# EAGLE design MEGA Shield (EAGLE 9.0.1)
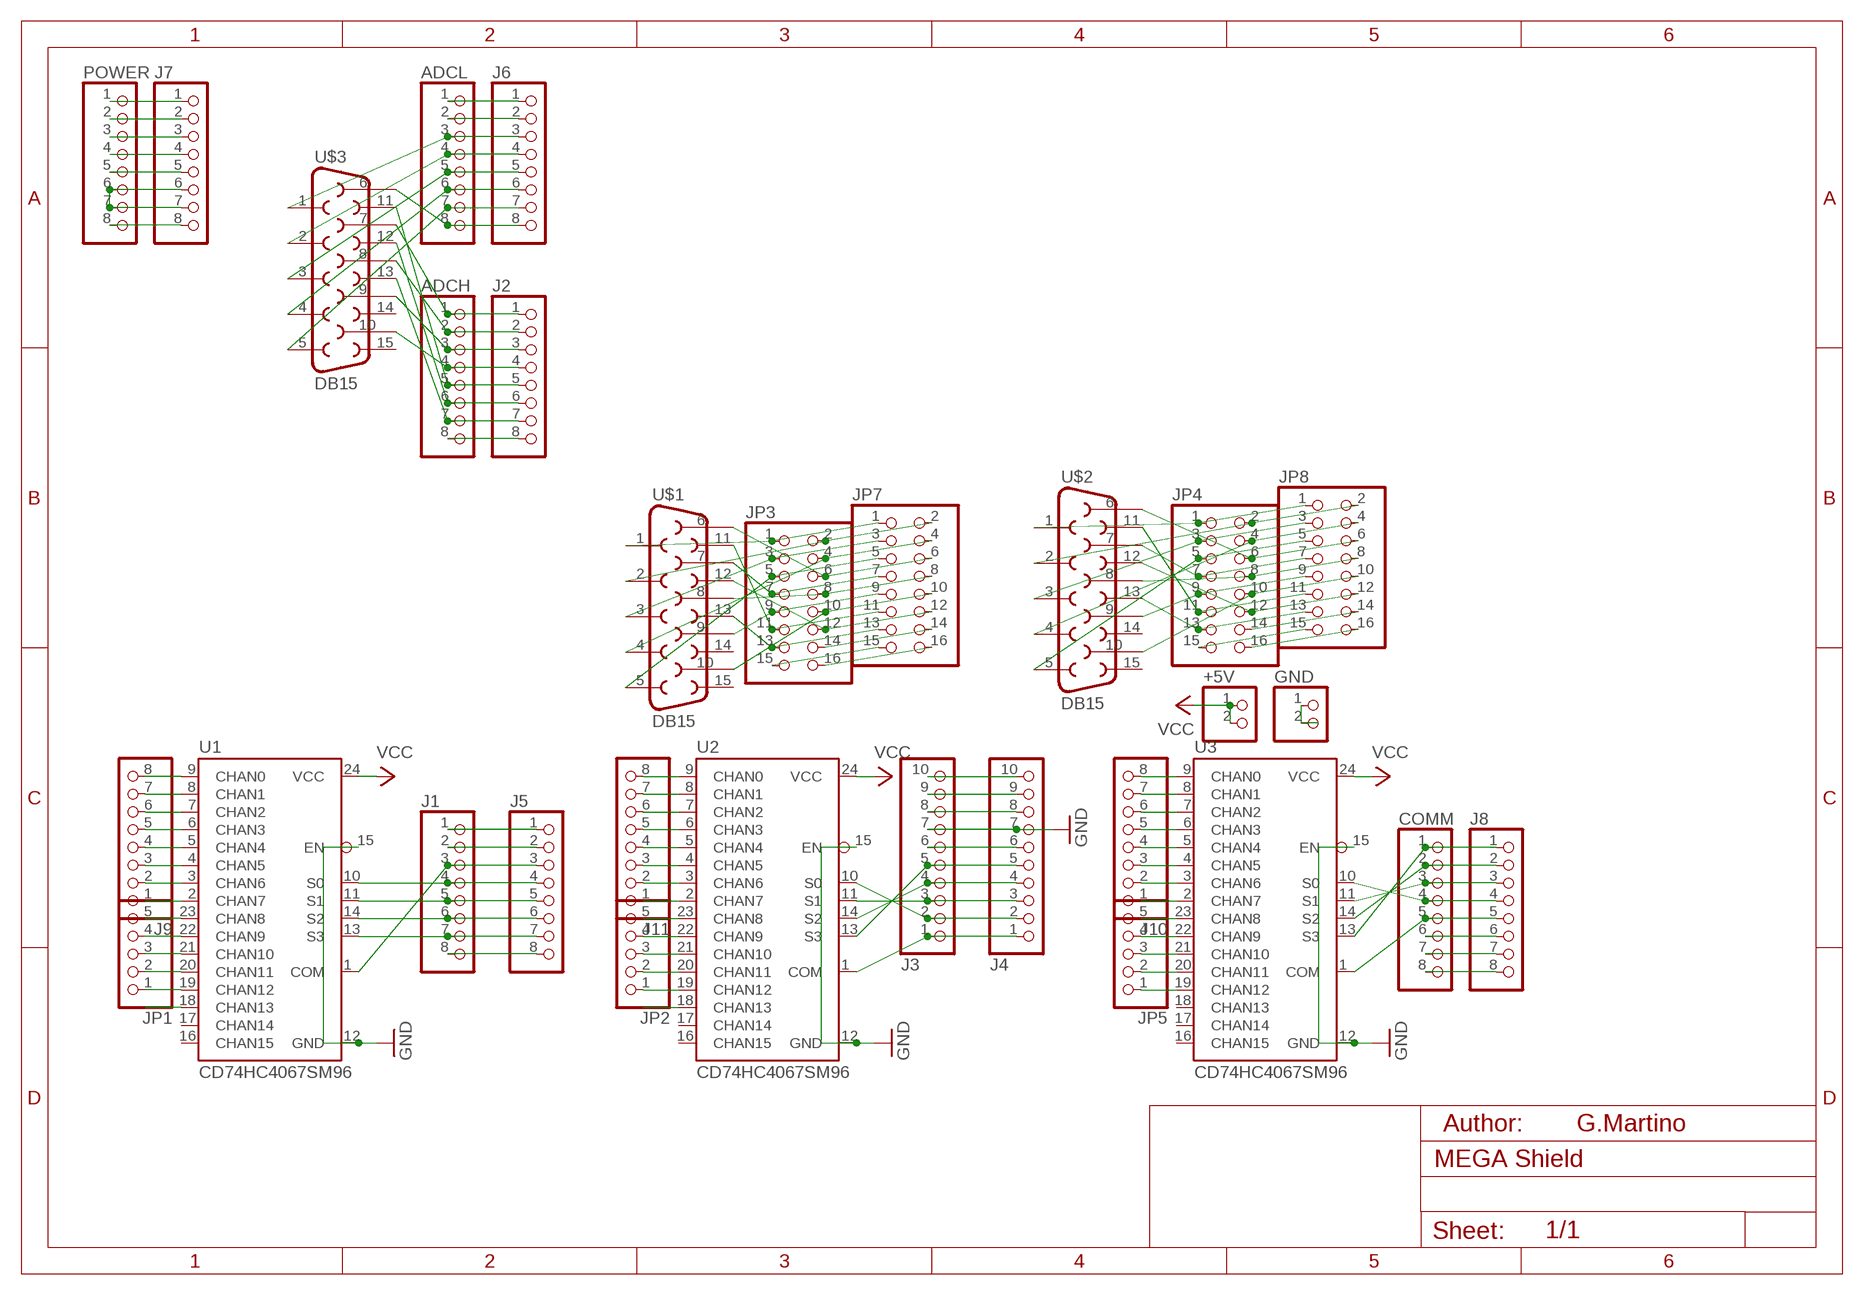
[diagram p0: schematic, sheet 1]

## Parts
+5V  PINHD-1X2  [1X02]
ADCH  PINHD-1X8TH  [1X08-TH]
ADCL  PINHD-1X8TH  [1X08-TH]
COMM  PINHD-1X8TH  [1X08-TH]
GND  PINHD-1X2  [1X02]
J1  PINHD-1X8TH  [1X08-TH]
J2  PINHD-1X8TH  [1X08-TH]
J3  PINHD-1X10TH  [1X10-TH]
J4  PINHD-1X10TH  [1X10-TH]
J5  PINHD-1X8TH  [1X08-TH]
J6  PINHD-1X8TH  [1X08-TH]
J7  PINHD-1X8TH  [1X08-TH]
J8  PINHD-1X8TH  [1X08-TH]
J9  PINHD-1X8TH  [1X08-TH]
J10  PINHD-1X8TH  [1X08-TH]
J11  PINHD-1X8TH  [1X08-TH]
JP1  PINHD-1X5  [1X05]
JP2  PINHD-1X5  [1X05]
JP3  PINHD-2X8  [2X08]
JP4  PINHD-2X8  [2X08]
JP5  PINHD-1X5  [1X05]
JP7  PINHD-2X8  [2X08]
JP8  PINHD-2X8  [2X08]
POWER  PINHD-1X8TH  [1X08-TH]
U1  CD74HC4067SM96  74HC4067SM96  [SSOP24]
U2  CD74HC4067SM96  74HC4067SM96  [SSOP24]
U3  CD74HC4067SM96  74HC4067SM96  [SSOP24]
U$1  DB15  [DB15]
U$2  DB15  [DB15]
U$3  DB15  [DB15]

## Nets
+9V: J7.8 POWER.8
GND: J3.7 J4.7 U1.12(GND) U1.15(EN) U2.12(GND) U2.15(EN) U3.12(GND) U3.15(EN)
N$1: GND.1 GND.2
N$2: J3.1 J4.1 U2.1(COM)
N$3: J3.6 J4.6
N$4: J7.5 POWER.5
N$5: J3.4 J4.4 U2.14(S2)
N$6: J3.2 J4.2 U2.10(S0)
N$7: J3.3 J4.3 U2.11(S1)
N$8: J1.1 J5.1
N$9: J1.2 J5.2
N$10: J1.3 J5.3 U1.1(COM)
N$11: J1.4 J5.4 U1.10(S0)
N$12: J1.5 J5.5 U1.11(S1)
N$13: J1.6 J5.6 U1.14(S2)
N$14: J1.7 J5.7 U1.13(S3)
N$15: J1.8 J5.8
N$16: J7.6 J7.7 POWER.6 POWER.7
N$17: J9.8 U1.9(CHAN0)
N$18: ADCL.1 J6.1
N$19: ADCL.2 J6.2
N$20: ADCL.3 J6.3 U$3.1
N$21: ADCL.4 J6.4 U$3.2
N$22: ADCL.5 J6.5 U$3.3
N$23: ADCL.6 J6.6 U$3.4
N$24: J9.7 U1.8(CHAN1)
N$25: J9.6 U1.7(CHAN2)
N$26: J9.5 U1.6(CHAN3)
N$27: J9.4 U1.5(CHAN4)
N$28: J9.3 U1.4(CHAN5)
N$29: J9.2 U1.3(CHAN6)
N$30: J9.1 U1.2(CHAN7)
N$31: JP1.5 U1.23(CHAN8)
N$32: JP1.4 U1.22(CHAN9)
N$33: JP1.3 U1.21(CHAN10)
N$34: JP1.2 U1.20(CHAN11)
N$35: JP1.1 U1.19(CHAN12)
N$36: U1.18(CHAN13)
N$37: J10.8 U3.9(CHAN0)
N$38: ADCL.7 J6.7 U$3.5
N$39: J10.7 U3.8(CHAN1)
N$40: J11.8 U2.9(CHAN0)
N$41: J11.7 U2.8(CHAN1)
N$42: J11.6 U2.7(CHAN2)
N$43: J11.5 U2.6(CHAN3)
N$44: J11.4 U2.5(CHAN4)
N$45: J11.3 U2.4(CHAN5)
N$46: J11.2 U2.3(CHAN6)
N$47: J11.1 U2.2(CHAN7)
N$48: JP2.5 U2.23(CHAN8)
N$49: JP2.4 U2.22(CHAN9)
N$50: JP2.3 U2.21(CHAN10)
N$51: JP2.2 U2.20(CHAN11)
N$52: JP2.1 U2.19(CHAN12)
N$53: U2.18(CHAN13)
N$54: J10.6 U3.7(CHAN2)
N$55: J10.5 U3.6(CHAN3)
N$56: J10.4 U3.5(CHAN4)
N$57: J10.3 U3.4(CHAN5)
N$58: J10.2 U3.3(CHAN6)
N$59: J10.1 U3.2(CHAN7)
N$60: JP5.5 U3.23(CHAN8)
N$61: JP5.4 U3.22(CHAN9)
N$62: JP5.3 U3.21(CHAN10)
N$63: ADCL.8 J6.8 U$3.6
N$64: ADCH.1 J2.1 U$3.7
N$65: JP5.2 U3.20(CHAN11)
N$66: JP5.1 U3.19(CHAN12)
N$88: ADCH.2 J2.2 U$3.8
N$89: ADCH.3 J2.3 U$3.9
N$116: ADCH.4 J2.4 U$3.10
N$121: ADCH.5 J2.5 U$3.11
N$124: ADCH.6 J2.6 U$3.12
N$125: J7.4 POWER.4
N$126: J3.9 J4.9
N$127: ADCH.7 J2.7 U$3.13
N$128: ADCH.8 J2.8
N$129: COMM.1 J8.1 U3.13(S3)
N$130: COMM.2 J8.2 U3.14(S2)
N$133: COMM.3 J8.3 U3.11(S1)
N$134: COMM.4 J8.4 U3.10(S0)
N$136: COMM.5 J8.5 U3.1(COM)
N$137: COMM.6 J8.6
N$138: COMM.7 J8.7
N$139: COMM.8 J8.8
N$140: J3.5 J4.5 U2.13(S3)
N$142: JP3.1 JP7.1 U$1.1
N$144: JP3.2 JP7.2 U$1.2
N$145: JP3.3 JP7.3 U$1.3
N$146: JP3.4 JP7.4 U$1.4
N$147: JP3.5 JP7.5 U$1.5
N$148: JP3.6 JP7.6 U$1.6
N$149: JP3.7 JP7.7 U$1.7
N$150: JP3.8 JP7.8 U$1.8
N$151: JP3.9 JP7.9 U$1.9
N$152: JP3.10 JP7.10 U$1.10
N$154: JP3.11 JP7.11 U$1.11
N$157: JP3.12 JP7.12 U$1.12
N$158: JP3.13 JP7.13 U$1.13
N$159: JP3.14 JP7.14
N$160: JP3.15 JP7.15
N$161: JP3.16 JP7.16
N$162: JP4.1 JP8.1 U$2.1
N$163: JP4.2 JP8.2 U$2.2
N$164: JP4.3 JP8.3 U$2.3
N$166: JP4.4 JP8.4 U$2.4
N$169: JP4.5 JP8.5 U$2.5
N$170: JP4.6 JP8.6 U$2.6
N$171: JP4.7 JP8.7 U$2.7
N$172: JP4.8 JP8.8 U$2.8
N$173: JP4.9 JP8.9 U$2.9
N$174: JP4.10 JP8.10 U$2.10
N$175: JP4.11 JP8.11 U$2.11
N$176: JP4.12 JP8.12 U$2.12
N$181: JP4.13 JP8.13 U$2.13
N$182: JP4.14 JP8.14
N$183: JP4.15 JP8.15
N$184: JP4.16 JP8.16
N$219: J7.2 POWER.2
N$220: J7.1 POWER.1
N$222: J3.8 J4.8
N$223: J3.10 J4.10
RESET: J7.3 POWER.3
VCC: +5V.1 +5V.2 U1.24(VCC) U2.24(VCC) U3.24(VCC)
Unconnected: U1.16(CHAN15) U1.17(CHAN14) U2.16(CHAN15) U2.17(CHAN14) U3.16(CHAN15) U3.17(CHAN14) U3.18(CHAN13) U$1.14 U$1.15 U$2.14 U$2.15 U$3.14 U$3.15

## Notes on the sheet
- G.Martino

## Library data of the parts
+5V GND = pinhead:PINHD-1X2: PIN HEADER
ADCH ADCL COMM J1 J2 J5-J11 POWER = Smartprj:PINHD-1X8: PIN HEADER
J3 J4 = Smartprj:PINHD-1X10: PIN HEADER
JP1 JP2 JP5 = pinhead:PINHD-1X5: PIN HEADER
JP3 JP4 JP7 JP8 = pinhead:PINHD-2X8: PIN HEADER
U1-U3 = SparkFun-IC-Logic:74*4067: 16-channel analog MUX Datasheet <http://www.sparkfun.com/datasheets/IC/cd74hc4067.pdf> SparkFun Products MP3 Trigger <https://www.sparkfun.com/products/13720> (WIG-13720) SparkFun Analog/Digital MUX Breakout - CD74HC4067 <https://www.sparkfun.com/products/9056> (BOB-09056); PROD_ID: IC-08252
U$1-U$3 = SparkFun-Retired:DB15: DB15 / VGA right angle through-hole female connector.

## Board
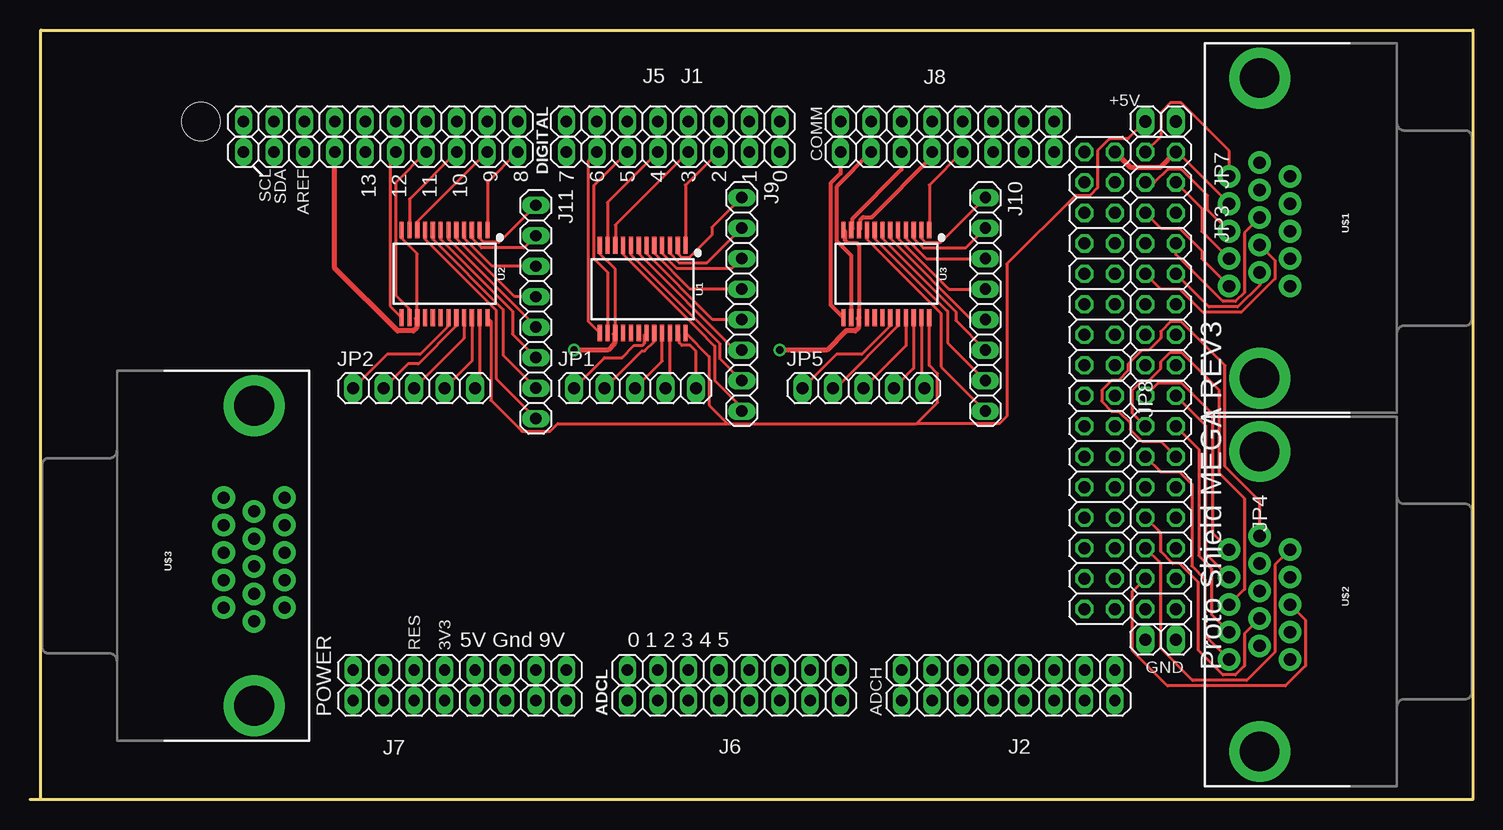
[diagram p1: board, top side]
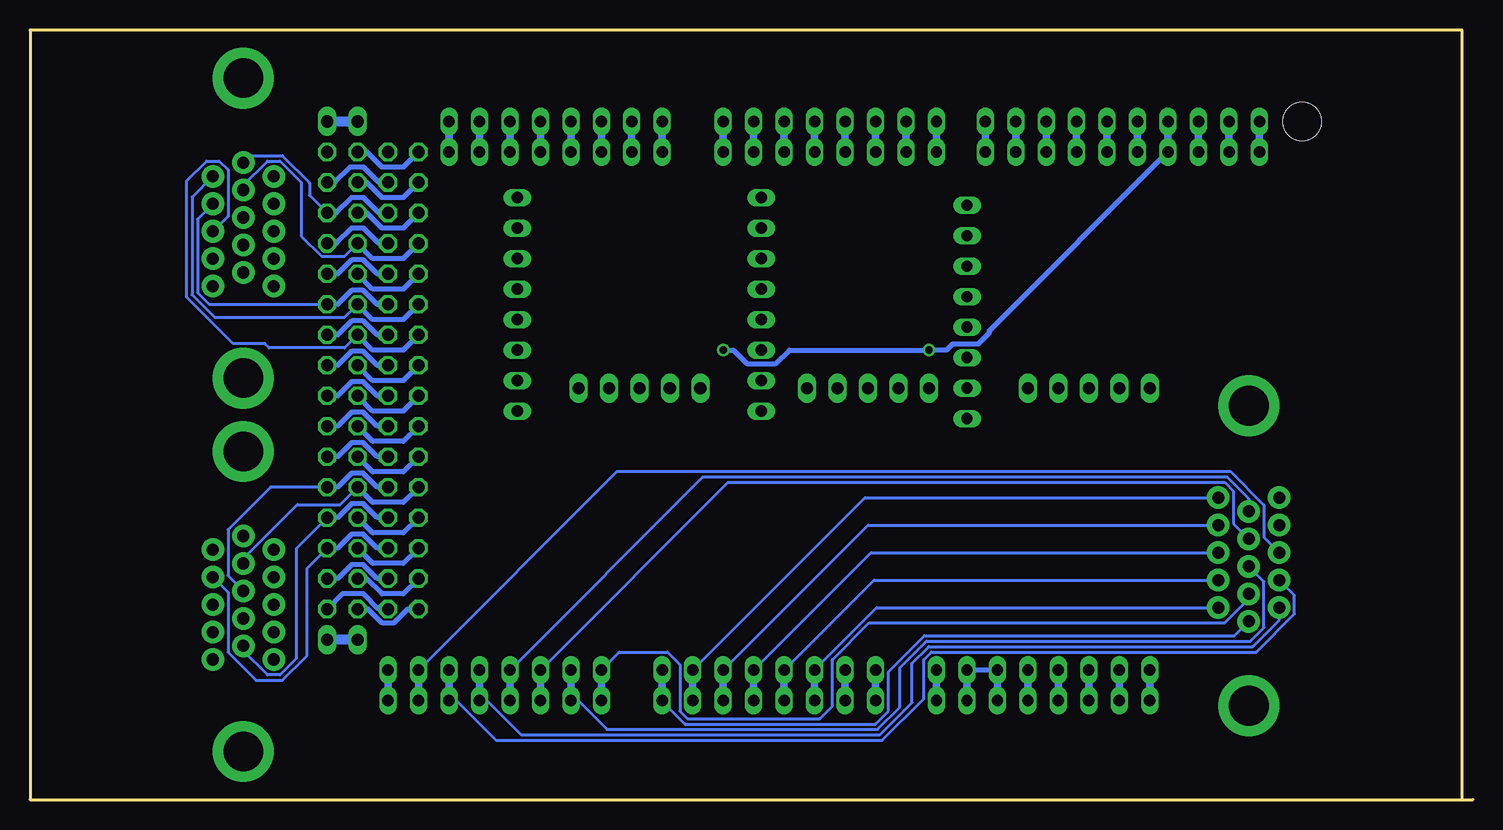
[diagram p2: board, bottom side, seen from below]

Size 120.28 x 64.14 mm. Coordinates in mm from the lower left corner, seen from the top.
Outline: 0.91,0 120.28,0 120.28,64.14 0.91,64.14 0.91,0
Outline: 0.91,0 0,0
Copper layers (1*16): Top 0.035mm / dielectric 1.5mm / Bottom 0.035mm
Design rules "default *": minimum track width 10mil, minimum drill 24mil, track to track 8mil, track to pad 8mil, pad to pad 8mil, via to via 8mil, smd to smd 8mil, copper to edge 40mil, drill to drill 8mil, minimum pad ring 10mil, minimum via ring 8mil, stop-mask expansion 2mil, vias tented up to drill 0mil, thermal gap 10mil
Holes 3.2 mm at 14.24,56.52

### Footprints (pad centres in the part's own frame; a part is rotated, then mirrored left to right if it is on the bottom)
1X02 = drill 1.016 long: 1 -1.27,0; 2 1.27,0
1X08-TH = drill 0.95 pad 1.422 long: 1 -8.89,0; 2 -6.35,0; 3 -3.81,0; 4 -1.27,0; 5 1.27,0; 6 3.81,0; 7 6.35,0; 8 8.89,0
1X10-TH = drill 0.95 pad 1.422 long: 1 -11.43,0; 2 -8.89,0; 3 -6.35,0; 4 -3.81,0; 5 -1.27,0; 6 1.27,0; 7 3.81,0; 8 6.35,0; 9 8.89,0; 10 11.43,0
1X05 = drill 1.016 long: 1 -5.08,0; 2 -2.54,0; 3 0,0; 4 2.54,0; 5 5.08,0
2X08 = drill 1.016 octagon: 1 -8.89,-1.27; 2 -8.89,1.27; 3 -6.35,-1.27; 4 -6.35,1.27; 5 -3.81,-1.27; 6 -3.81,1.27; 7 -1.27,-1.27; 8 -1.27,1.27; 9 1.27,-1.27; 10 1.27,1.27; 11 3.81,-1.27; 12 3.81,1.27; 13 6.35,-1.27; 14 6.35,1.27; 15 8.89,-1.27; 16 8.89,1.27
SSOP24 = smd 0.348 x 1.397: 1 -3.575,-3.656; 2 -2.925,-3.656; 3 -2.275,-3.656; 4 -1.625,-3.656; 5 -0.975,-3.656; 6 -0.325,-3.656; 7 0.325,-3.656; 8 0.975,-3.656; 9 1.625,-3.656; 10 2.275,-3.656; 11 2.925,-3.656; 12 3.575,-3.656; 13 3.575,3.656; 14 2.925,3.656; 15 2.275,3.656; 16 1.625,3.656; 17 0.975,3.656; 18 0.325,3.656; 19 -0.325,3.656; 20 -0.975,3.656; 21 -1.625,3.656; 22 -2.275,3.656; 23 -2.925,3.656; 24 -3.575,3.656
DB15 = drill 1.016 pad 1.88: 1 -4.32,-7.62; 2 -2.03,-7.62; 3 0.26,-7.62; 4 2.55,-7.62; 5 4.84,-7.62; 6 -5.46,-5.08; 7 -3.17,-5.08; 8 -0.88,-5.08; 9 1.41,-5.08; 10 3.7,-5.08; 11 -4.32,-2.54; 12 -2.03,-2.54; 13 0.26,-2.54; 14 2.55,-2.54; 15 4.84,-2.54 | drill 3.302 pad 5.08: G1 -12.5,-5.08; G2 12.5,-5.08

### Placement (x,y rotation side)
+5V  94.25,56.52 0 top
ADCH  81.55,8.25 0 top
ADCL  58.69,8.25 0 top
COMM  76.47,56.52 0 top
GND  94.25,13.34 0 top
J1  53.61,56.52 180 top
J2  81.55,10.79 0 top
J3  29.23,56.52 180 top
J4  29.23,53.97 180 top
J5  53.61,53.97 180 top
J6  58.69,10.79 0 top
J7  35.83,8.25 0 top
J8  76.47,53.97 0 top
J9  59.33,41.28 270 top
J10  79.64,41.28 270 top
J11  42.18,40.64 270 top
JP1  50.44,34.29 0 top
JP2  32.02,34.29 0 top
JP3  94.25,45.08 270 top
JP4  94.25,24.77 270 top
JP5  69.48,34.29 0 top
JP7  89.17,45.08 270 top
JP8  89.17,24.77 270 top
POWER  35.83,10.79 0 top
U1  51.07,42.55 180 top
U2  34.56,43.81 180 top
U3  71.39,43.81 180 top
U$1  107.58,47.62 270 top
U$2  107.58,16.51 270 top
U$3  13.61,20.32 90 top

### Tracks (layer width: path | path; a pad name or v marks a point on that pad's centre or on a via)
+9V
  Bottom 0.61: J7.8 POWER.8
GND  (via drill 0.61)
  Top 0.254: U1.15 48.8,44.2 47.49,45.5 U1.12 | U2.15 32.28,45.47 30.98,46.77 U2.12
  Top 0.33: U3.15 69.11,46.17 68.88,46.4 68.14,46.4 67.92,46.62 67.92,47.36 U3.12
  Top 0.406: U2.15 32.22,40.09 32.22,39.29 31.98,39.05 30.64,39.05 25.42,44.28 J4.7 | U1.15 48.73,38.82 48.73,38.02 48.17,37.47 v45.35,37.47 | v62.5,37.47 66.42,37.47 68.01,39.05 68.81,39.05 69.05,39.29 69.05,40.09 U3.15
  Bottom 0.406: J4.7 40.32,39.08 40.32,38.9 41.25,37.97 43.38,37.97 43.88,37.47 v45.35,37.47 56.99,37.47 58.13,36.33 60.52,36.33 61.66,37.47 v62.5,37.47
  Bottom 0.61: J4.7 J3.7
N$1
  Bottom 0.813: GND.1 GND.2
N$2
  Top 0.254: J4.1 38.13,51.45 U2.1
  Bottom 0.61: J4.1 J3.1
N$3
  Bottom 0.61: J4.6 J3.6
N$4
  Bottom 0.61: POWER.5 J7.5
N$5
  Top 0.254: J4.4 30.48,51.42 30.48,42.01 31.63,40.86 U2.14
  Bottom 0.61: J4.4 J3.4
N$6
  Top 0.254: J4.2 38.1,53.97 32.28,48.16 U2.10
  Bottom 0.61: J4.2 J3.2
N$7
  Top 0.254: J4.3 31.63,50.03 U2.11
  Bottom 0.61: J4.3 J3.3
N$8
  Bottom 0.61: J5.1 J1.1
N$9
  Bottom 0.61: J5.2 J1.2
N$10
  Top 0.254: J5.3 54.65,51.2 U1.1
  Bottom 0.61: J5.3 J1.3
N$11
  Top 0.254: J5.4 48.8,47.89 U1.10
  Bottom 0.61: J5.4 J1.4
N$12
  Top 0.254: J5.5 48.15,49.78 U1.11
  Bottom 0.61: J5.5 J1.5
N$13
  Top 0.254: J5.6 46.99,51.17 46.99,45.11 48.15,43.95 U1.14
  Bottom 0.61: J5.6 J1.6
N$14
  Top 0.254: J5.7 46.53,53.25 46.53,39.85 U1.13
  Bottom 0.61: J5.7 J1.7
N$15
  Bottom 0.61: J5.8 J1.8
N$16
  Bottom 0.406: POWER.6 POWER.7
  Bottom 0.61: POWER.6 J7.6 | POWER.7 J7.7
N$17
  Top 0.254: U1.9 49.45,45.43 55.51,39.36 55.63,39.24 57.07,37.8 57.07,34.95 59.33,32.7 J9.8
N$18
  Bottom 0.61: ADCL.1 J6.1
N$19
  Bottom 0.61: ADCL.2 J6.2
N$20
  Bottom 0.254: J6.3 54.88,10.84 49.72,16 U$3.1
  Bottom 0.61: ADCL.3 J6.3
N$21
  Bottom 0.254: J6.4 49.92,18.29 U$3.2
  Bottom 0.61: ADCL.4 J6.4
N$22
  Bottom 0.254: J6.5 50.17,20.58 U$3.3
  Bottom 0.61: ADCL.5 J6.5
N$23
  Bottom 0.254: J6.6 50.42,22.87 U$3.4
  Bottom 0.61: ADCL.6 J6.6
N$24
  Top 0.254: J9.7 57.53,36.72 57.53,37.99 50.09,45.42 U1.8
N$25
  Top 0.254: J9.6 58.79,37.47 50.74,45.51 U1.7
N$26
  Top 0.254: J9.5 56.9,40 51.4,45.51 U1.6
N$27
  Top 0.254: J9.4 55.01,42.55 52.05,45.51 U1.5
N$28
  Top 0.254: J9.3 58.5,44.26 53.95,44.26 52.7,45.51 U1.4
N$29
  Top 0.254: J9.2 56.41,44.72 54.14,44.72 53.34,45.51 U1.3
N$30
  Top 0.254: J9.1 56.85,47.69 56.85,47.07 54.96,45.17 54.33,45.17 53.99,45.51 U1.2
N$31
  Top 0.254: JP1.5 55.52,37.37 55.02,37.86 54.33,37.86 54.14,38.05 54.14,38.74 U1.23
N$32
  Top 0.254: JP1.4 53.34,34.66 U1.22
N$33
  Top 0.254: JP1.3 52.7,36.55 U1.21
N$34
  Top 0.254: JP1.2 51.01,37.4 51.25,37.4 52.05,38.2 U1.20
N$35
  Top 0.254: JP1.1 47.9,36.83 49.34,36.83 50.37,37.86 51.06,37.86 51.25,38.05 51.25,38.74 U1.19
N$37
  Top 0.254: U3.9 69.77,46.7 75.95,40.51 75.95,36.08 J10.8
N$38
  Bottom 0.254: J6.7 50.67,25.16 U$3.5
  Bottom 0.61: ADCL.7 J6.7
N$39
  Top 0.254: U3.8 70.42,46.78 76.5,40.7 76.5,38.08 J10.7
N$40
  Top 0.254: J11.8 38.88,35.05 38.88,40.75 32.94,46.7 U2.9
N$41
  Top 0.254: U2.8 33.59,46.69 39.45,40.83 39.45,37.02 J11.7
N$42
  Top 0.254: U2.7 34.23,46.69 40.23,40.7 40.23,38.78 J11.6
N$43
  Top 0.254: U2.6 34.88,46.69 42.18,39.39 J11.5
N$44
  Top 0.254: J11.4 40.41,41.91 35.53,46.78 U2.5
N$45
  Top 0.254: J11.3 38.52,44.45 36.19,46.78 U2.4
N$46
  Top 0.254: J11.2 41.17,45.98 37.63,45.98 36.84,46.78 U2.3
N$47
  Top 0.254: J11.1 39.09,46.44 37.82,46.44 37.48,46.78 U2.2
N$48
  Top 0.254: U2.23 37.48,34.67 JP2.5
N$49
  Top 0.254: U2.22 36.84,36.56 JP2.4
N$50
  Top 0.254: U2.21 36.19,38.45 JP2.3
N$51
  Top 0.254: U2.20 35.53,39.47 32.38,36.32 31.51,36.32 JP2.2
N$52
  Top 0.254: U2.19 34.88,39.47 32.52,37.1 29.75,37.1 JP2.1
N$54
  Top 0.254: U3.7 71.06,46.78 77.17,40.67 77.17,39.94 J10.6
N$55
  Top 0.254: U3.6 71.72,46.78 78.49,40 J10.5
N$56
  Top 0.254: U3.5 72.36,46.78 76.6,42.55 J10.4
N$57
  Top 0.254: U3.4 73.02,46.78 74.71,45.08 J10.3
N$58
  Top 0.254: U3.3 73.67,46.78 74.46,45.98 78,45.98 J10.2
N$59
  Top 0.254: U3.2 74.31,46.78 74.65,46.44 75.92,46.44 J10.1
N$60
  Top 0.254: U3.23 74.31,34.54 JP5.5
N$61
  Top 0.254: U3.22 73.67,35.93 JP5.4
N$62
  Top 0.254: U3.21 73.02,37.82 JP5.3
N$63
  Bottom 0.254: J6.8 67.58,8.21 65.67,6.3 49.82,6.3 48.74,7.38 48.74,10.65 45.73,13.66 19.88,13.66 U$3.6
  Bottom 0.61: ADCL.8 J6.8
N$64
  Bottom 0.254: J2.1 71.16,12.29 67.14,12.29 66.1,11.25 66.1,7.38 65.48,6.76 54.44,6.76 53.4,7.8 53.4,11.67 50.34,14.73 20.7,14.73 18.68,16.74 U$3.7
  Bottom 0.61: ADCH.1 J2.1
N$65
  Top 0.254: U3.20 72.36,39.47 67.19,34.29 JP5.2
N$66
  Top 0.254: U3.19 71.72,39.47 69.35,37.1 67.22,37.1 JP5.1
N$88
  Bottom 0.254: J2.2 75.2,8.86 72.18,5.84 49.63,5.84 47.77,7.71 47.77,10.98 45.54,13.21 18.54,13.21 17.41,14.33 17.41,18.17 U$3.8
  Bottom 0.61: ADCH.2 J2.2
N$89
  Bottom 0.254: J2.3 62.1,26.43 20.7,26.43 19.95,25.69 19.95,23 U$3.9
  Bottom 0.61: ADCH.3 J2.3
N$116
  Bottom 0.254: J2.4 64.19,26.89 20.51,26.89 18.68,25.06 U$3.10
  Bottom 0.61: ADCH.4 J2.4
N$121
  Bottom 0.254: J2.5 82.82,8.86 79.35,5.39 49.44,5.39 46.75,8.07 46.75,11.34 45.35,12.75 18.35,12.75 16.14,14.96 U$3.11
  Bottom 0.61: ADCH.5 J2.5
N$124
  Bottom 0.254: J2.6 85.36,8.86 81.43,4.93 49.25,4.93 45.78,8.4 45.78,11.67 45.16,12.29 18.06,12.29 14.88,15.47 14.88,17.02 U$3.12
  Bottom 0.61: ADCH.6 J2.6
N$125
  Bottom 0.61: J7.4 POWER.4
N$126
  Bottom 0.61: J4.9 J3.9
N$127
  Bottom 0.254: J2.7 71.35,27.34 20.21,27.34 17.41,24.55 17.41,21.85 U$3.13
  Bottom 0.61: ADCH.7 J2.7
N$128
  Bottom 0.61: ADCH.8 J2.8
N$129
  Top 0.33: J8.1 67.58,52.19 66.74,51.35 66.74,41.23 U3.13
  Bottom 0.61: J8.1 COMM.1
N$130
  Top 0.33: U3.14 68.47,45.32 67.27,46.52 67.27,51.13 J8.2
  Bottom 0.61: J8.2 COMM.2
N$133
  Top 0.33: U3.11 68.57,47.58 68.57,48.43 72.66,52.51 J8.3
  Bottom 0.61: J8.3 COMM.3
N$134
  Top 0.33: J8.4 75.2,53.56 70.18,48.54 69.44,48.54 69.22,48.32 69.22,47.58 U3.10
  Bottom 0.61: J8.4 COMM.4
N$136
  Top 0.254: J8.5 74.97,51.2 U3.1
  Bottom 0.61: J8.5 COMM.5
N$137
  Bottom 0.61: J8.6 COMM.6
N$138
  Bottom 0.61: J8.7 COMM.7
N$139
  Bottom 0.61: J8.8 COMM.8
N$140
  Top 0.254: J4.5 30.02,53.5 30.02,41.12 U2.13
  Bottom 0.61: J4.5 J3.5
N$142
  Top 0.254: U$1.1 99.97,54.07 95.97,58.06 95.07,58.06 94.25,57.25 94.25,55.25 JP3.1
  Bottom 0.406: JP7.1 89.17,52.7 90.95,52.7 92.22,53.97 JP3.1
N$144
  Top 0.254: JP3.2 95.64,53.97 U$1.2
  Top 0.406: JP3.2 94.25,52.7 91.71,52.7 JP7.2
N$145
  Top 0.254: U$1.3 98.16,49.17 98.16,50.34 95.97,52.53 94.83,52.53 93.74,51.44 JP3.3
  Bottom 0.406: JP7.3 89.17,50.17 90.95,50.17 92.22,51.44 JP3.3
N$146
  Top 0.254: JP3.4 97.68,49.28 97.68,47.36 U$1.4
  Bottom 0.406: JP3.4 94.89,51.44 93.61,52.7 92.47,52.7 91.2,51.44 JP7.4
N$147
  Top 0.254: JP3.5 94.25,47.62 95.8,47.62 97.67,45.75 97.67,45.08 U$1.5
  Bottom 0.406: JP7.5 89.17,47.62 90.95,47.62 92.22,48.89 JP3.5
N$148
  Bottom 0.254: U$1.6 101.92,53.67 99.25,53.67 96.97,51.4 96.97,50.35 JP3.6
  Bottom 0.406: JP3.6 94.76,48.89 93.49,50.17 92.47,50.17 91.2,48.89 JP7.6
N$149
  Bottom 0.254: U$1.7 102.5,51.2 100.49,53.22 99.44,53.22 97.67,51.44 97.67,46.96 95.97,45.26 94.07,45.26 JP3.7
  Bottom 0.406: JP7.7 89.17,45.08 91.71,45.08 JP3.7
N$150
  Top 0.254: U$1.8 101.23,47.23 101.23,42.26 100.49,41.52 99.44,41.52 95.52,45.43 JP3.8
  Bottom 0.406: JP3.8 94.76,46.36 93.49,47.62 92.47,47.62 91.2,46.36 JP7.8
N$151
  Top 0.254: U$1.9 103.78,44.94 103.78,43.4 100.98,40.6 97.78,40.6 95.84,42.55 94.25,42.55 JP3.9
  Bottom 0.406: JP7.9 89.17,42.55 91.71,42.55 JP3.9
N$152
  Top 0.254: U$1.10 102.5,42.88 100.68,41.06 98.28,41.06 JP3.10
  Bottom 0.406: JP7.10 91.33,43.81 92.5,44.98 93.46,44.98 94.63,43.81 JP3.10
N$154
  Bottom 0.254: U$1.11 106.77,50.22 106.77,42.07 104.89,40.18 94.07,40.18 JP3.11
  Bottom 0.406: JP7.11 89.17,40 91.71,40 JP3.11
N$157
  Bottom 0.254: U$1.12 106.31,48.39 106.31,42.26 105.33,41.28 JP3.12
  Bottom 0.406: JP7.12 91.33,41.28 92.5,42.44 93.46,42.44 94.63,41.28 JP3.12
N$158
  Bottom 0.254: JP3.13 94.07,37.64 100.36,37.64 100.71,38 103.34,38 107.23,41.88 107.23,51.56 105.57,53.22 104.52,53.22 103.78,52.47 103.78,48.64 U$1.13
  Bottom 0.406: JP7.13 89.17,37.47 91.71,37.47 JP3.13
N$159
  Bottom 0.406: JP7.14 91.33,38.73 92.5,39.9 93.46,39.9 94.63,38.73 JP3.14
N$160
  Bottom 0.406: JP7.15 89.17,34.92 91.71,34.92 JP3.15
N$161
  Bottom 0.406: JP7.16 91.33,36.2 92.5,37.36 93.46,37.36 94.63,36.2 JP3.16
N$162
  Top 0.254: JP4.1 94.07,34.75 95.97,34.75 98.56,32.16 98.56,22.24 U$2.1
  Bottom 0.406: JP8.1 89.17,32.39 91.71,32.39 JP4.1
N$163
  Top 0.254: JP4.2 97.99,31.19 97.99,20.52 U$2.2
  Bottom 0.406: JP8.2 91.33,33.66 92.5,34.82 93.46,34.82 94.63,33.66 JP4.2
N$164
  Top 0.254: JP4.3 91.89,32.21 91.89,34.11 92.7,34.92 93.25,34.92 94.25,35.92 94.25,36.47 95.07,37.29 95.97,37.29 99.12,34.14 99.12,27.22 101.23,25.11 101.23,17.52 U$2.3
  Bottom 0.406: JP8.3 89.17,29.84 91.71,29.84 JP4.3
N$166
  Top 0.254: JP4.4 97.42,29.22 97.42,20.32 98.49,19.25 98.49,15.44 U$2.4
  Bottom 0.406: JP8.4 91.33,31.11 92.5,32.28 93.46,32.28 94.63,31.11 JP4.4
N$169
  Top 0.254: JP4.5 94.25,27.3 95.8,27.3 96.84,26.26 96.84,19.48 97.94,18.38 97.94,13.7 U$2.5
  Bottom 0.406: JP8.5 89.17,27.3 91.71,27.3 JP4.5
N$170
  Top 0.254: U$2.6 102.5,24.88 99.61,27.77 99.61,36.19 95.97,39.83 95.07,39.83 94.25,39.01 94.25,38.46 93.25,37.47 92.7,37.47 91.54,36.3 91.54,35.75 90.72,34.92 90.17,34.92 89.35,34.11 89.35,33.2 90.17,32.39 90.72,32.39 91.71,31.39 91.71,30.84 92.7,29.84 94.25,29.84 JP4.6
  Bottom 0.406: JP8.6 91.33,28.57 92.5,29.74 93.46,29.74 94.63,28.57 JP4.6
N$171
  Bottom 0.254: U$2.7 102.5,20.09 98,24.59 94.43,24.59 JP4.7
  Bottom 0.406: JP8.7 89.17,24.77 91.71,24.77 JP4.7
N$172
  Bottom 0.254: JP4.8 100.24,26.04 103.78,22.5 103.78,18.66 U$2.8
  Bottom 0.406: JP8.8 91.33,26.04 92.5,27.2 93.46,27.2 94.63,26.04 JP4.8
N$173
  Top 0.254: U$2.9 101.23,13.83 101.23,11.14 100.49,10.4 99.44,10.4 97.38,12.46 97.38,18.1 95.8,19.69 95.25,19.69 94.25,20.68 94.25,22.23 JP4.9
  Bottom 0.406: JP8.9 89.17,22.23 91.71,22.23 JP4.9
N$174
  Bottom 0.254: JP4.10 98.1,20.92 98.1,11.74 99.44,10.4 100.49,10.4 102.5,12.41 U$2.10
  Bottom 0.406: JP8.10 91.33,23.5 92.5,24.66 93.46,24.66 94.63,23.5 JP4.10
N$175
  Top 0.254: U$2.11 103.78,19.56 103.78,12.28 101.43,9.94 96.91,9.94 94.25,12.6 94.25,19.69 JP4.11
  Bottom 0.406: JP8.11 89.17,19.69 91.71,19.69 JP4.11
N$176
  Bottom 0.254: U$2.12 103.78,17.27 103.78,12.28 101.43,9.94 99.25,9.94 97.2,12 97.2,19.28 JP4.12
  Bottom 0.406: JP8.12 91.33,20.95 92.5,22.12 93.46,22.12 94.63,20.95 JP4.12
N$181
  Top 0.254: U$2.13 106.31,14.98 106.31,11.14 104.66,9.49 94.83,9.49 91.89,12.43 91.89,17.32 JP4.13
  Bottom 0.406: JP8.13 89.17,17.14 90.95,17.14 92.22,18.41 JP4.13
N$182
  Bottom 0.406: JP4.14 94.63,18.41 93.46,19.58 92.5,19.58 91.33,18.41 JP8.14
N$183
  Bottom 0.406: JP8.15 88.79,15.88 89.96,14.71 90.92,14.71 92.09,15.88 JP4.15
N$184
  Bottom 0.406: JP4.16 94.25,17.14 92.47,17.14 91.2,15.88 JP8.16
N$219
  Bottom 0.61: J7.2 POWER.2
N$220
  Bottom 0.61: J7.1 POWER.1
N$222
  Bottom 0.61: J4.8 J3.8
N$223
  Bottom 0.61: J4.10 J3.10
RESET
  Bottom 0.61: POWER.3 J7.3
VCC
  Top 0.254: U1.24 56.62,36.92 56.62,32.87 58.16,31.33 | U3.24 74.97,36.2 75.66,35.5 75.66,33.08 73.91,31.33 | 58.16,31.33 73.91,31.33 | U2.24 38.42,39.87 38.42,33.28 41.01,30.69 43.35,30.69 43.98,31.33 58.16,31.33 | +5V.1 91.53,55.07 89.99,55.07 88.99,54.07 88.99,50.98 88.35,50.34 87.13,50.34 81.43,44.65 81.43,31.95 80.81,31.33 73.91,31.33
  Bottom 0.813: +5V.2 +5V.1

### Text on the board
tPlace: 9 | 8 | 7 | 6 | 5 | 4 | 3 | 2 | 1 | 0 | 13 | 12 | 11 | 10 | Proto Shield MEGA REV3
tNames: DIGITAL | SCL | SDA | AREF | RES | 3V3 | 5V Gnd 9V | 0 1 2 3 4 5
bStop: DIGITAL | COMM | 5V | SCL | SDA | AREF | GND | 13 | 12 | 11 | 10 | 9 | 8 | 7 | 6 | 5 | 4 | 3 | 2 | 1 | 0 | TX3 | RX3 | TX2 | RX2 | TX1 | RX1 | SDA | SCL | 31 | 33 | 35 | 37 | 39 | 41 | 43 | 45 | 47 | 49 | 51 | 53 | IOREF | RST | 3.3V | 5V | GND | GND | VIN | 0 | 1 | 2 | 3 | 4 | 5 | 7 | 8 | 9 | 10 | 11 | 12 | 13 | 14 | 15 | ANALOG | ANALOG | GND